# Altium schematic sheet Sheet3.SchDoc
size 420 x 297 mm
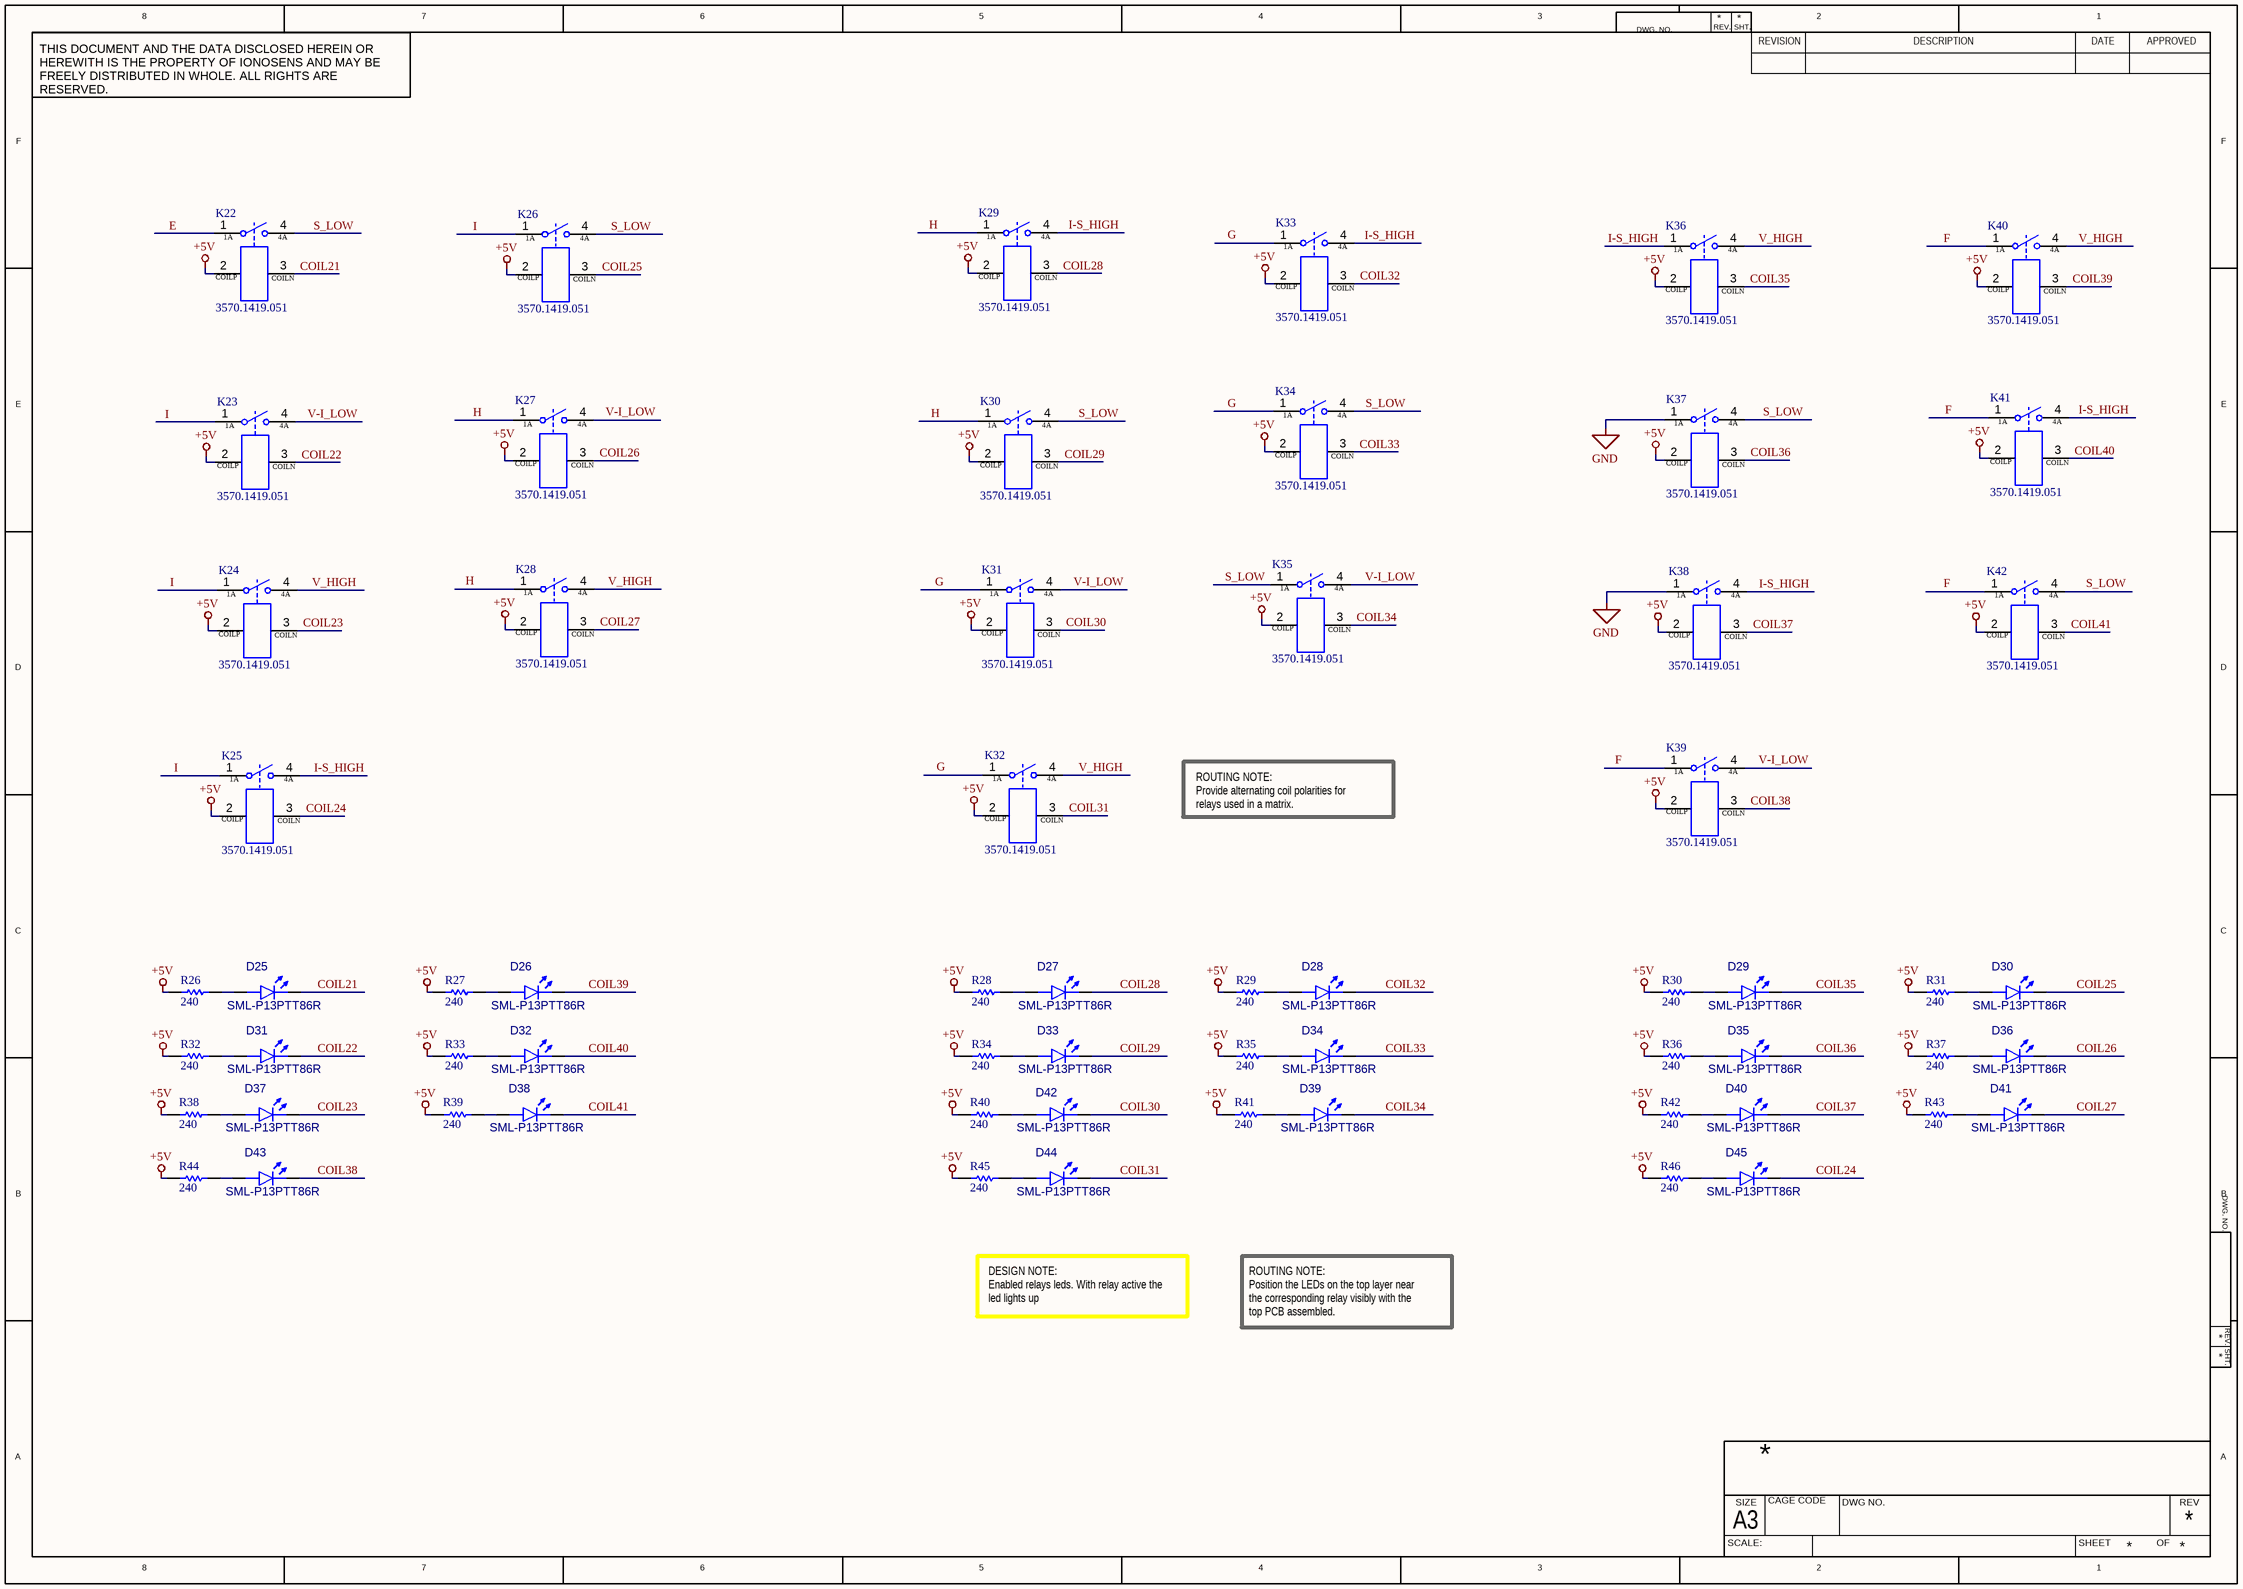
[diagram p0: Sheet3.SchDoc]

## Parts
D25  SML-P13PTT86R  [DIOC1005X02R]
D26  SML-P13PTT86R  [DIOC1005X02R]
D27  SML-P13PTT86R  [DIOC1005X02R]
D28  SML-P13PTT86R  [DIOC1005X02R]
D29  SML-P13PTT86R  [DIOC1005X02R]
D30  SML-P13PTT86R  [DIOC1005X02R]
D31  SML-P13PTT86R  [DIOC1005X02R]
D32  SML-P13PTT86R  [DIOC1005X02R]
D33  SML-P13PTT86R  [DIOC1005X02R]
D34  SML-P13PTT86R  [DIOC1005X02R]
D35  SML-P13PTT86R  [DIOC1005X02R]
D36  SML-P13PTT86R  [DIOC1005X02R]
D37  SML-P13PTT86R  [DIOC1005X02R]
D38  SML-P13PTT86R  [DIOC1005X02R]
D39  SML-P13PTT86R  [DIOC1005X02R]
D40  SML-P13PTT86R  [DIOC1005X02R]
D41  SML-P13PTT86R  [DIOC1005X02R]
D42  SML-P13PTT86R  [DIOC1005X02R]
D43  SML-P13PTT86R  [DIOC1005X02R]
D44  SML-P13PTT86R  [DIOC1005X02R]
D45  SML-P13PTT86R  [DIOC1005X02R]
K22  3570.1419.051  [3570.1419]
K23  3570.1419.051  [3570.1419]
K24  3570.1419.051  [3570.1419]
K25  3570.1419.051  [3570.1419]
K26  3570.1419.051  [3570.1419]
K27  3570.1419.051  [3570.1419]
K28  3570.1419.051  [3570.1419]
K29  3570.1419.051  [3570.1419]
K30  3570.1419.051  [3570.1419]
K31  3570.1419.051  [3570.1419]
K32  3570.1419.051  [3570.1419]
K33  3570.1419.051  [3570.1419]
K34  3570.1419.051  [3570.1419]
K35  3570.1419.051  [3570.1419]
K36  3570.1419.051  [3570.1419]
K37  3570.1419.051  [3570.1419]
K38  3570.1419.051  [3570.1419]
K39  3570.1419.051  [3570.1419]
K40  3570.1419.051  [3570.1419]
K41  3570.1419.051  [3570.1419]
K42  3570.1419.051  [3570.1419]
R26  value 240  [RESC1005X04M]  (hidden comment: AC0402FR-07240RL)
R27  value 240  [RESC1005X04M]  (hidden comment: AC0402FR-07240RL)
R28  value 240  [RESC1005X04M]  (hidden comment: AC0402FR-07240RL)
R29  value 240  [RESC1005X04M]  (hidden comment: AC0402FR-07240RL)
R30  value 240  [RESC1005X04M]  (hidden comment: AC0402FR-07240RL)
R31  value 240  [RESC1005X04M]  (hidden comment: AC0402FR-07240RL)
R32  value 240  [RESC1005X04M]  (hidden comment: AC0402FR-07240RL)
R33  value 240  [RESC1005X04M]  (hidden comment: AC0402FR-07240RL)
R34  value 240  [RESC1005X04M]  (hidden comment: AC0402FR-07240RL)
R35  value 240  [RESC1005X04M]  (hidden comment: AC0402FR-07240RL)
R36  value 240  [RESC1005X04M]  (hidden comment: AC0402FR-07240RL)
R37  value 240  [RESC1005X04M]  (hidden comment: AC0402FR-07240RL)
R38  value 240  [RESC1005X04M]  (hidden comment: AC0402FR-07240RL)
R39  value 240  [RESC1005X04M]  (hidden comment: AC0402FR-07240RL)
R40  value 240  [RESC1005X04M]  (hidden comment: AC0402FR-07240RL)
R41  value 240  [RESC1005X04M]  (hidden comment: AC0402FR-07240RL)
R42  value 240  [RESC1005X04M]  (hidden comment: AC0402FR-07240RL)
R43  value 240  [RESC1005X04M]  (hidden comment: AC0402FR-07240RL)
R44  value 240  [RESC1005X04M]  (hidden comment: AC0402FR-07240RL)
R45  value 240  [RESC1005X04M]  (hidden comment: AC0402FR-07240RL)
R46  value 240  [RESC1005X04M]  (hidden comment: AC0402FR-07240RL)

## Nets
+5V: K22.2(COILP) K23.2(COILP) K24.2(COILP) K25.2(COILP) K26.2(COILP) K27.2(COILP) K28.2(COILP) K29.2(COILP) K30.2(COILP) K31.2(COILP) K32.2(COILP) K33.2(COILP) K34.2(COILP) K35.2(COILP) K36.2(COILP) K37.2(COILP) K38.2(COILP) K39.2(COILP) K40.2(COILP) K41.2(COILP) K42.2(COILP) R26.1 R27.1 R28.1 R29.1 R30.1 R31.1 R32.1 R33.1 R34.1 R35.1 R36.1 R37.1 R38.1 R39.1 R40.1 R41.1 R42.1 R43.1 R44.1 R45.1 R46.1
GND: K37.1(1A) K38.1(1A)
COIL21: D25.1(K) K22.3(COILN)
COIL22: D31.1(K) K23.3(COILN)
COIL23: D37.1(K) K24.3(COILN)
COIL24: D45.1(K) K25.3(COILN)
COIL25: D30.1(K) K26.3(COILN)
COIL26: D36.1(K) K27.3(COILN)
COIL27: D41.1(K) K28.3(COILN)
COIL28: D27.1(K) K29.3(COILN)
COIL29: D33.1(K) K30.3(COILN)
COIL30: D42.1(K) K31.3(COILN)
COIL31: D44.1(K) K32.3(COILN)
COIL32: D28.1(K) K33.3(COILN)
COIL33: D34.1(K) K34.3(COILN)
COIL34: D39.1(K) K35.3(COILN)
COIL35: D29.1(K) K36.3(COILN)
COIL36: D35.1(K) K37.3(COILN)
COIL37: D40.1(K) K38.3(COILN)
COIL38: D43.1(K) K39.3(COILN)
COIL39: D26.1(K) K40.3(COILN)
COIL40: D32.1(K) K41.3(COILN)
COIL41: D38.1(K) K42.3(COILN)
E: K22.1(1A)
F: K39.1(1A) K40.1(1A) K41.1(1A) K42.1(1A)
G: K31.1(1A) K32.1(1A) K33.1(1A) K34.1(1A)
H: K27.1(1A) K28.1(1A) K29.1(1A) K30.1(1A)
I: K23.1(1A) K24.1(1A) K25.1(1A) K26.1(1A)
I-S_HIGH: K25.4(4A) K29.4(4A) K33.4(4A) K36.1(1A) K38.4(4A) K41.4(4A)
S_LOW: K22.4(4A) K26.4(4A) K30.4(4A) K34.4(4A) K35.1(1A) K37.4(4A) K42.4(4A)
V-I_LOW: K23.4(4A) K27.4(4A) K31.4(4A) K35.4(4A) K39.4(4A)
V_HIGH: K24.4(4A) K28.4(4A) K32.4(4A) K36.4(4A) K40.4(4A)
NetD25_2: D25.2(A) R26.2
NetD26_2: D26.2(A) R27.2
NetD27_2: D27.2(A) R28.2
NetD28_2: D28.2(A) R29.2
NetD29_2: D29.2(A) R30.2
NetD30_2: D30.2(A) R31.2
NetD31_2: D31.2(A) R32.2
NetD32_2: D32.2(A) R33.2
NetD33_2: D33.2(A) R34.2
NetD34_2: D34.2(A) R35.2
NetD35_2: D35.2(A) R36.2
NetD36_2: D36.2(A) R37.2
NetD37_2: D37.2(A) R38.2
NetD38_2: D38.2(A) R39.2
NetD39_2: D39.2(A) R41.2
NetD40_2: D40.2(A) R42.2
NetD41_2: D41.2(A) R43.2
NetD42_2: D42.2(A) R40.2
NetD43_2: D43.2(A) R44.2
NetD44_2: D44.2(A) R45.2
NetD45_2: D45.2(A) R46.2

## Notes on the sheet
- ROUTING NOTE:
  Provide alternating coil polarities for relays used in a matrix.
- DESIGN NOTE:
  Enabled relays leds. With relay active the led lights up
- ROUTING NOTE:
  Position the LEDs on the top layer near the corresponding relay visibly with the top PCB assembled.
- 8
- 7
- 6
- 5
- 4
- 3
- DWG. NO.
- REV.
- SHT.
- REVISION
- 2
- DESCRIPTION
- DATE
- 1
- APPROVED
- THIS DOCUMENT AND THE DATA DISCLOSED HEREIN OR HEREWITH IS THE PROPERTY OF IONOSENS AND MAY BE FREELY DISTRIBUTED IN WHOLE. ALL RIGHTS ARE RESERVED.
- F
- E
- D
- C
- B
- A
- SCALE:
- A3
- SIZE
- CAGE CODE
- DWG NO.
- SHEET
- OF
- REV

## Library data of the parts
D25-D45 = D01-0402-01-00000-1: Led green 0402; Manufacturer: ROHM; Forward Voltage: 2.1V; Max Power Dissipation: 52mW; Forward Current: 20 mA; Number of LEDs: 1; Dominant Wavelength: 560 nm; Luminous Intensity: 10 mcd; Lens Style: Rectangular, Square; Min Operating Temperature: -40°C; Mounting Technology: SMD; Colour: Green; Manufacturer P/N: SML-P13PTT86R; Max Operating Temperature: 85°C; Pins: 2; RoHS Compliant: Yes; Case/Package: 0402
K22-K42 = K01-0008-01-00008-1: Reed Relay, Mini SIP, 5 VDC; 1 Form A, 15W, 200 VDC, 1.25A; Manufacturer: Comus; Number of Terminal: 4; Contact Current Rating: 1A; Coil Current: 10mA; Switching Voltage: 200V; Rise time: 0s; Contact Resistence: 0.15; Coil resitence: 500; Operate Time: 350µs; Coil Voltage (DC): 5V; Insulation Resistance: 0; Release Time: 100µs; Manufacturer P/N: 3570.1419.051; Mounting Technology: TH; Contact Material: -; Relay Type: Reed; Width: 15.24mm; Contact Form: 1A; Packaging: SIP; Switching Current: 1A; Pins: 4; Case/Package: SIP; Coil Type: -; Min Operating Temperature: -40°C; RoHS: Yes; Height: 6.98mm; Max Operating Temperature: 85°C
R26-R46 = R01-0402-01-00437-2: RES SMD 240 OHM 1% 1/16W 0402; Manufacturer: Yageo; Temperature Coefficient: 100 ppm/ºC; Power Rating: 62.5mW; Voltage Rating: 50V; Packaging: Tape & Reel; Manufacturer P/N: AC0402FR-07240RL; Height: 370µm; Case/Package: 0402; Composition: Thick Film; Max Operating Temperature: 155°C; Number of Terminations: 2; RoHS: Yes; Min Operating Temperature: -55°C; Tolerance: 1%; Width: 508µm; Length: 990.6µm; Features: Automotive AEC-Q200, Moisture Resistant